# EAGLE schematic simpleledboard (EAGLE 9.6.2)
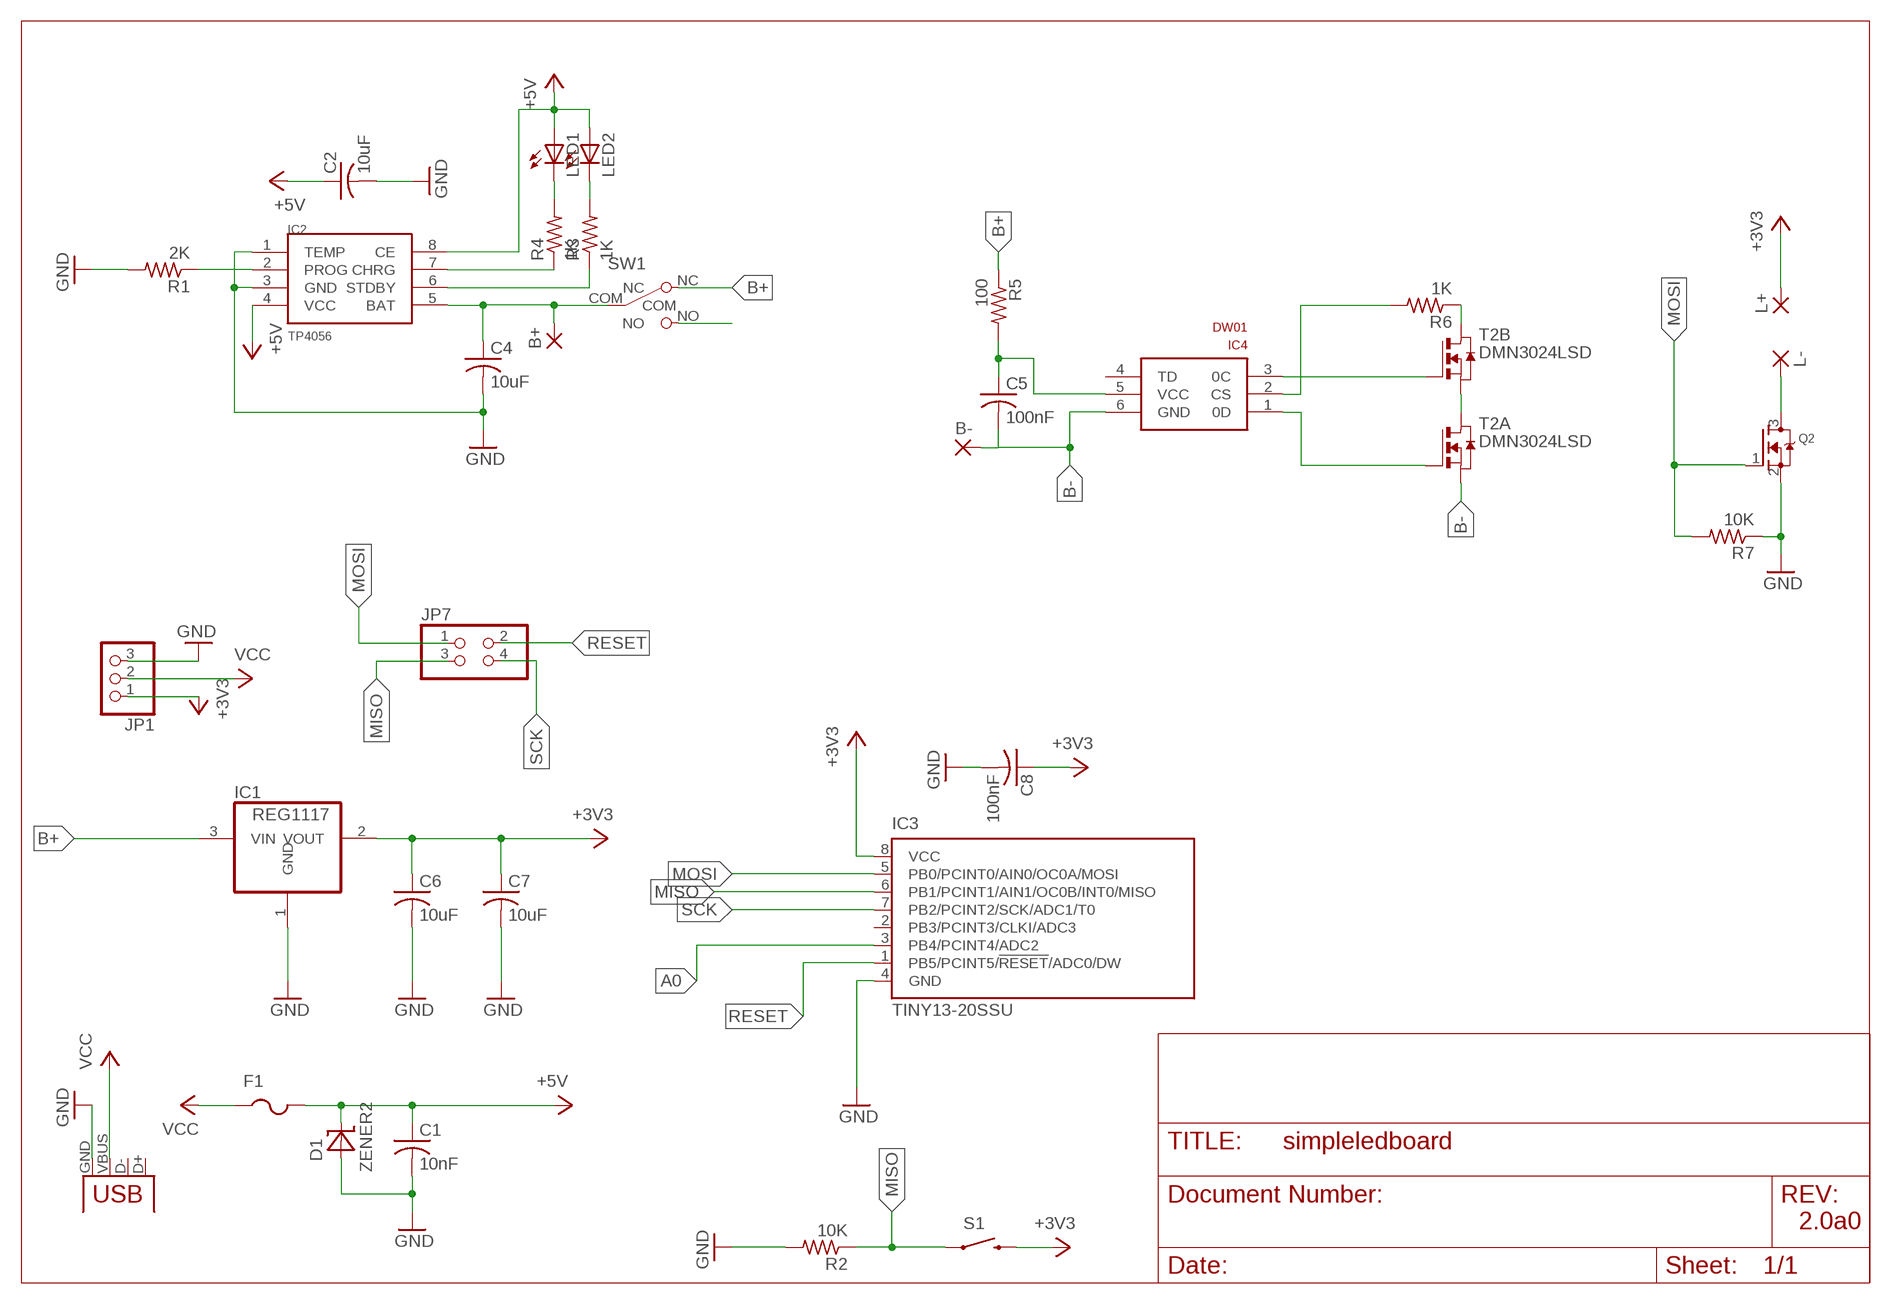
[diagram p0: schematic, sheet 1]

## Parts
B+  WIREPADSMD1,27-254  [SMD1,27-2,54]
B-  WIREPADSMD1,27-254  [SMD1,27-2,54]
C1  10nF  C-USC0603  [C0603]
C2  10uF  C-USC0603  [C0603]
C4  10uF  C-USC0603  [C0603]
C5  100nF  C-USC0603  [C0603]
C6  10uF  C-USC0603  [C0603]
C7  10uF  C-USC0603  [C0603]
C8  100nF  C-USC0603  [C0603]
D1  ZENER2  [SOD123]
F1  PTCFUSE-1206  [R1206]
IC1  REG1117  [SOT223]
IC2  TP4056  [SOP-8]
IC3  TINY13-20SSU  [8S1]
IC4  DW01  [SOT23-6]
JP1  PINHD-1X3CB  [1X03-CLEANBIG]
JP7  PINHD-2X2  [2X02]
L+  SMD2  [SMD1,27-2,54]
L-  SMD2  [SMD1,27-2,54]
LED1  LED0603  [LED-0603]
LED2  LED0603  [LED-0603]
Q2  MOSFET-NREFLOW  [SOT23]
R1  2K  R-US_R0603  [R0603]
R2  10K  R-US_R0603  [R0603]
R3  1K  R-US_R0603  [R0603]
R4  1K  R-US_R0603  [R0603]
R5  100  R-US_R1206  [R1206]
R6  1K  R-US_R0603  [R0603]
R7  10K  R-US_R0603  [R0603]
S1  SWITCH-MOMENTARY-2SMD-4.6X2.8MM  [TACTILE_SWITCH_SMD_4.6X2.8MM]
SW1  SW_SLIDE  [SLIDE_SWITCH_SMD]
T2  DMN3024LSD  [TSSOP-8]
X2  USB-MICROB  [USB-MICROB]

## Nets
+3V3: C6.1 C7.1 C8.1 IC1.2(VOUT) IC3.8(VCC) JP1.1 L+.1(P) S1.3 S1.4
+5V: C1.1 C2.1 D1.C F1.2 IC2.4(VCC) IC2.8(CE) LED1.A LED2.A
A0: IC3.3(PB4/PCINT4/ADC2)
B+: IC1.3(VIN) R5.1 SW1.NC
B+TMP: B+.1(P) C4.1 IC2.5(BAT) SW1.COM
B-: B-.1(P) C5.2 IC4.6(GND) T2.2(A:S) T2.3(A:S)
GND: C1.2 C2.2 C4.2 C6.2 C7.2 C8.2 D1.A IC1.1(GND) IC2.1(TEMP) IC2.3(GND) IC3.4(GND) JP1.3 Q2.2(S) R1.2 R2.2 R7.1 X2.GND
MISO: IC3.6(PB1/PCINT1/AIN1/OC0B/INT0/MISO) JP7.3 R2.1 S1.1 S1.2
MOSI: IC3.5(PB0/PCINT0/AIN0/OC0A/MOSI) JP7.1 Q2.1(G) R7.2
N$1: IC2.7(CHRG) R4.1
N$2: IC4.1(0D) T2.4(A:G)
N$3: T2.1(A:D) T2.6(B:S) T2.7(B:S)
N$4: LED1.C R4.2
N$5: IC4.3(0C) T2.5(B:G)
N$6: IC4.2(CS) R6.2
N$7: C5.1 IC4.5(VCC) R5.2
N$8: R6.1 T2.8(B:D)
N$9: L-.1(P) Q2.3(D)
N$10: SW1.NO
N$11: LED2.C R3.2
N$12: IC2.6(STDBY) R3.1
N$14: IC2.2(PROG) R1.1
RESET: IC3.1(PB5/PCINT5/!RESET!/ADC0/DW) JP7.2
SCK: IC3.7(PB2/PCINT2/SCK/ADC1/T0) JP7.4
VCC: F1.1 JP1.2 X2.VBUS
Unconnected: IC3.2(PB3/PCINT3/CLKI/ADC3) IC4.4(TD) X2.D+ X2.D-

## Notes on the sheet
- 2.0a0

## Library data of the parts
B+ B- = wirepad:WIREPAD: Wire PAD connect wire on PCB
C1 C2 C4-C8 = adafruit:C-US: CAPACITOR, American symbol
D1 = smt_diodes:ZENER
F1 = adafruit:PTCFUSE: PTC fuses, resettable thermistors
IC1 = burr-brown:REG1117: 800mA and 1A Low Dropout (LDO) Positive Regulator 1.8V, 2.5V, 2.85V, 3.3V, 5V, and Adj; MPN: REG1117; OC_FARNELL: 1097566; OC_NEWARK: 14P6981
IC2 = TP4056:TP4056
IC3 = atmel:TINY13: 8-bit AVR Microcontroller with 1K Bytes In-System Programmable Flash Source: http://www.atmel.com/dyn/resources/prod_documents/2535S.pdf; MPN: ATTINY13-20SSU; OC_FARNELL: 1455133; OC_NEWARK: 58M3771
IC4 = DW01:DW01: The DW01-P battery protection IC is designed to protect lithium-ion/polymer battery from damage or degrading the lifetime due to overcharge, overdischarge, and/or overcurrent for one-cell lithium-ion/polymer battery powered systems, such as cellular phones. Data sheet <http://goo.gl/4y108d> Dave.Calaway Eagle Library <https://goo.gl/Muy1Tr>
JP1 = adafruit:PINHD-1X3: PIN HEADER
JP7 = pinhead:PINHD-2X2: PIN HEADER
L+ L- = wirepad:SMD2: SMD PAD
LED1 LED2 = SparkFun:LED: LEDs Standard schematic elements and footprints for 5mm, 3mm, 1206, and 0603 sized LEDs. 5mm - Spark Fun Electronics SKU : COM-00529 (and others)
Q2 = adafruit:MOSFET-N: N-Channel Mosfet 2N7002E - 60V 260mA SOT23 [Digikey: 2N7002ET1GOSTR-ND] - REEL BSH103 - 30V 850mA SOT23 [Digikey: 568-5013-1-ND]
R1-R7 = adafruit:R-US_: RESISTOR, American symbol
S1 = SparkFun-Electromechanical:SWITCH-MOMENTARY-2: Various NO switches- pushbuttons, reed, etc; PROD_ID: SWCH-13065
SW1 = dp_devices:SW_SLIDE
T2 = FS8205A:DMN3024LSD: DUAL N-CHANNEL ENHANCEMENT MODE MOSFET data sheet <http://goo.gl/dRgboR> Dave.Calaway Eagle Library <https://goo.gl/Muy1Tr>
X2 = SparkFun:USB: USB Connectors USB-B-PTH is fully proven SKU : PRT-00139 USB-miniB is fully proven SKU : PRT-00587 USB-A-PCB is untested. USB-A-H is throughly reviewed, but untested. Spark Fun Electronics SKU : PRT-00437 USB-B-SMT is throughly reviewed, but untested. Needs silkscreen touching up. USB-A-S has not been used/tested USB-MB-H has not been used/tested